# EAGLE design rocket-mega-shield (EAGLE 6.4)
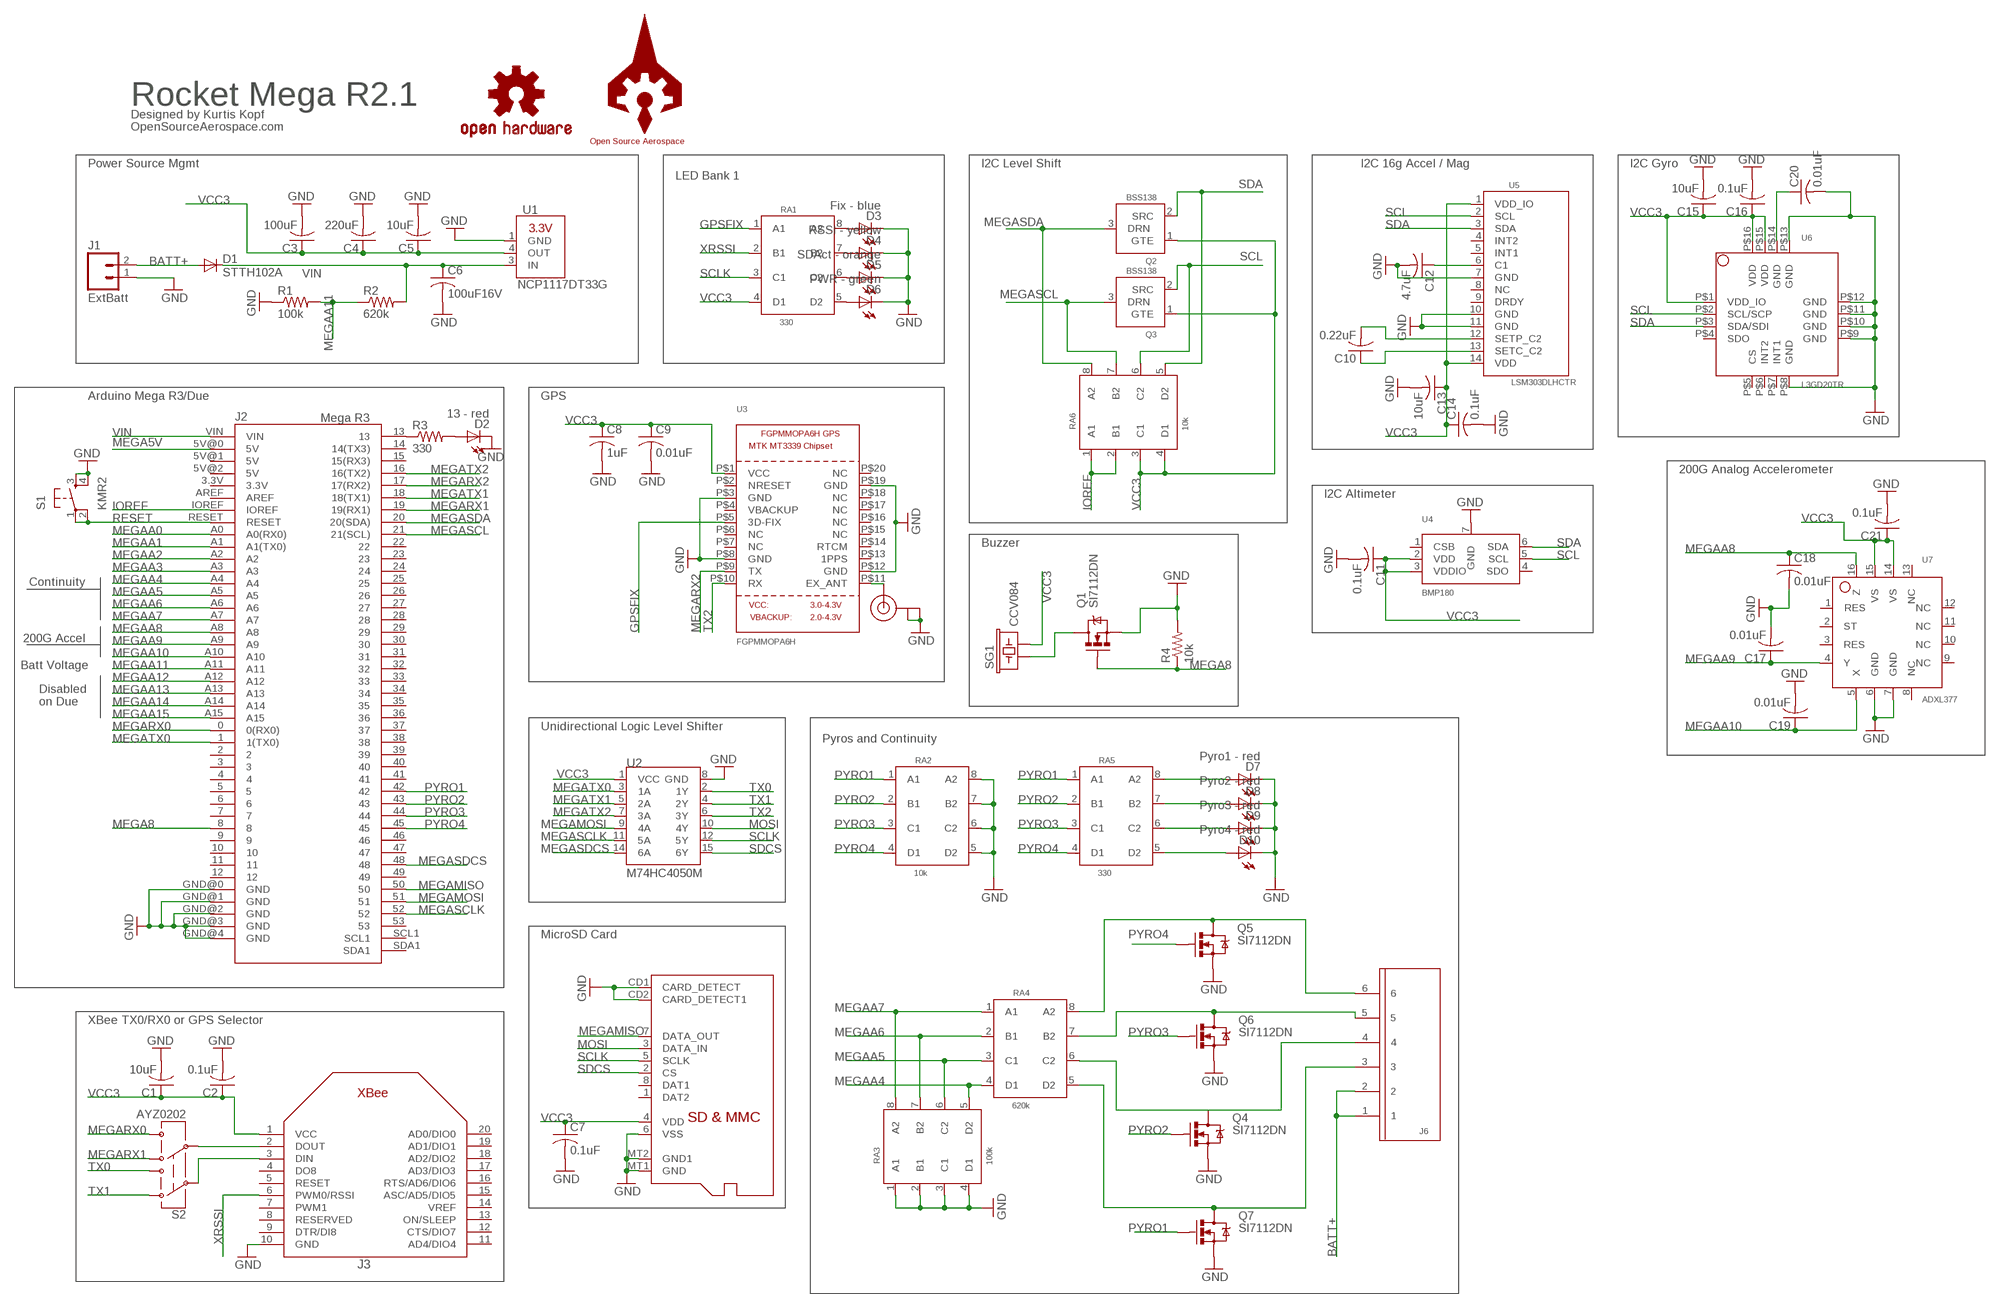
[diagram p0: schematic, sheet 1]

## Parts
C1  10uF  C-USC1206  [C1206]
C2  0.1uF  C-USC1206  [C1206]
C3  100uF  C-USC1206  [C1206]
C4  220uF  C-USC1210  [C1210]
C5  10uF  C-USC1206  [C1206]
C6  100uF16V  C-USC1210  [C1210]
C7  0.1uF  C-USC1206  [C1206]
C8  1uF  C-USC1206  [C1206]
C9  0.01uF  C-USC1206  [C1206]
C10  0.22uF  C-USC1206  [C1206]
C11  0.1uF  C-USC1206  [C1206]
C12  4.7uF  C-USC1206  [C1206]
C13  10uF  C-USC1206  [C1206]
C14  0.1uF  C-USC1206  [C1206]
C15  10uF  C-USC1206  [C1206]
C16  0.1uF  C-USC1206  [C1206]
C17  0.01uF  C-USC1206  [C1206]
C18  0.01uF  C-USC1206  [C1206]
C19  0.01uF  C-USC1206  [C1206]
C20  0.01uF  C-USC1206  [C1206]
C21  0.1uF  C-USC1206  [C1206]
D1  STTH102A  DIODESMA-ALT  [SMA-DIODE_ALT]
D2  13 - red  LED1206  [LED-1206]
D3  Fix - blue  LED1206  [LED-1206]
D4  RSSI - yellow  LED1206  [LED-1206]
D5  SDAct - orange  LED1206  [LED-1206]
D6  PWR - green  LED1206  [LED-1206]
D7  Pyro1 - red  LED1206  [LED-1206]
D8  Pyro2 - red  LED1206  [LED-1206]
D9  Pyro3 - red  LED1206  [LED-1206]
D10  Pyro4 - red  LED1206  [LED-1206]
J1  ExtBatt  M02-JST-2-PTH-NO_SILK  [JST-2-PTH-NS]
J2  Mega R3  ARDUINO-MEGAFULL  [ARDUINO_MEGA]
J3  XBEE  [XBEE]
J4  MICROSD  [MICROSD]
J5  U.FL  [U.FL]
J6  1X6TERMINALBLOCK  [1X6TERMINALBLOCK]
LOGO1  OSHW-LOGOM  [OSHW-LOGO-M]
Q1  SI7112DN  MOSFET-NCHANNELSI7820DN  [POWERPAK1212-8]
Q2  BSS138  [SOT23]
Q3  BSS138  [SOT23]
Q4  SI7112DN  MOSFET-NCHANNELSI7820DN  [POWERPAK1212-8]
Q5  SI7112DN  MOSFET-NCHANNELSI7820DN  [POWERPAK1212-8]
Q6  SI7112DN  MOSFET-NCHANNELSI7820DN  [POWERPAK1212-8]
Q7  SI7112DN  MOSFET-NCHANNELSI7820DN  [POWERPAK1212-8]
R1  100k  R-US_R1206  [R1206]
R2  620k  R-US_R1206  [R1206]
R3  330  R-US_R1206  [R1206]
R4  10k  R-US_R1206  [R1206]
RA1  330  RESISTOR_CRA06S08  [1206X4RESISTORARRAY]
RA2  10k  RESISTOR_CRA06S08  [1206X4RESISTORARRAY]
RA3  100k  RESISTOR_CRA06S08  [1206X4RESISTORARRAY]
RA4  620k  RESISTOR_CRA06S08  [1206X4RESISTORARRAY]
RA5  330  RESISTOR_CRA06S08  [1206X4RESISTORARRAY]
RA6  10k  RESISTOR_CRA06S08  [1206X4RESISTORARRAY]
S1  KMR2  TAC_SWITCHKMR2  [TACTILE_KMR2]
S2  AYZ0202  [AYZ0202]
SG1  CCV084  BUZZERSMD2  [BUZZER-CCV]
U1  NCP1117DT33G  [DPAK]
U2  M74HC4050M  HEX_CONVERTER  [SO016]
U3  FGPMMOPA6H  GPS_FGPMMOPA6H  [FGPMMOPA6H]
U4  BMP180  [BMP180]
U5  LSM303DLHCTR  LSM303DLHC  [LGA14]
U6  L3GD20TR  L3GD20  [LGA16-4X4]
U7  ADXL377  [LFCSP-16]
U$1  OSAEROSPACEVECTOR  [OSAEROSPACE_V]

## Nets
BATT+ [raw]: D1.A J1.2 J6.1 J6.2
GND: C1.2 C2.2 C3.2 C4.2 C5.2 C6.2 C7.2 C8.2 C9.2 C11.2 C12.2 C13.2 C14.2 C15.2 C16.2 C17.2 C18.2 C19.2 C20.2 C21.2 D2.C D3.C D4.C D5.C D6.C D7.C D8.C D9.C D10.C J1.1 J2.GND@0(GND) J2.GND@1(GND) J2.GND@2(GND) J2.GND@3(GND) J2.GND@4(GND) J3.10(GND) J4.6(VSS) J4.CD1(CARD_DETECT) J4.CD2(CARD_DETECT1) J4.MT1(GND) J4.MT2(GND1) J5.P$1(GND) J5.P$2(GND) Q1.S1(S) Q1.S2(S) Q1.S3(S) Q4.S1(S) Q4.S2(S) Q4.S3(S) Q5.S1(S) Q5.S2(S) Q5.S3(S) Q6.S1(S) Q6.S2(S) Q6.S3(S) Q7.S1(S) Q7.S2(S) Q7.S3(S) R1.1 R4.2 RA2.5(D2) RA2.6(C2) RA2.7(B2) RA2.8(A2) RA3.1(A1) RA3.2(B1) RA3.3(C1) RA3.4(D1) S1.3 S1.4 U1.1(GND) U2.8(GND) U3.P$3(GND) U3.P$8(GND) U3.P$12(GND) U3.P$19(GND) U4.7(GND) U5.7(GND) U5.10(GND) U5.11(GND) U6.P$8(GND) U6.P$9(GND) U6.P$10(GND) U6.P$11(GND) U6.P$12(GND) U6.P$13(GND) U7.6(GND) U7.7(GND)
GPSFIX: RA1.1(A1) U3.P$5(3D-FIX)
IOREF: J2.IOREF RA6.1(A1) RA6.2(B1)
MEGA5V [pwr]: J2.5V@0(5V)
MEGA8: J2.8 Q1.G R4.1
MEGAA0: J2.A0(A0(RX0))
MEGAA1: J2.A1(A1(TX0))
MEGAA2: J2.A2
MEGAA3: J2.A3
MEGAA4: J2.A4 RA3.5(D2) RA4.4(D1)
MEGAA5: J2.A5 RA3.6(C2) RA4.3(C1)
MEGAA6: J2.A6 RA3.7(B2) RA4.2(B1)
MEGAA7: J2.A7 RA3.8(A2) RA4.1(A1)
MEGAA8: C18.1 J2.A8 U7.16(Z)
MEGAA9: C17.1 J2.A9 U7.4(Y)
MEGAA10: C19.1 J2.A10 U7.5(X)
MEGAA11: J2.A11 R1.2 R2.1
MEGAA12: J2.A12
MEGAA13: J2.A13
MEGAA14: J2.A14
MEGAA15: J2.A15
MEGAMISO: J2.50 J4.7(DATA_OUT)
MEGAMOSI: J2.51 U2.9(4A)
MEGARX0: J2.0(0(RX0)) S2.4
MEGARX1: J2.19(19(RX1)) S2.6
MEGARX2: J2.17(17(RX2)) U3.P$9(TX)
MEGASCL: J2.21(21(SCL)) Q3.3(DRN) RA6.7(B2)
MEGASCLK: J2.52 U2.11(5A)
MEGASDA: J2.20(20(SDA)) Q2.3(DRN) RA6.8(A2)
MEGASDCS: J2.48 U2.14(6A)
MEGATX0: J2.1(1(TX0)) U2.3(1A)
MEGATX1: J2.18(18(TX1)) U2.5(2A)
MEGATX2: J2.16(16(TX2)) U2.7(3A)
MOSI: J4.3(DATA_IN) U2.10(4Y)
N$1: D6.A RA1.5(D2)
N$2: D5.A RA1.6(C2)
N$3: J6.3 Q7.D1(D) Q7.D2(D) Q7.D3(D) Q7.D4(D) Q7.DPAD(D) RA4.5(D2)
N$4: J6.4 Q4.D1(D) Q4.D2(D) Q4.D3(D) Q4.D4(D) Q4.DPAD(D) RA4.6(C2)
N$5: C10.2 U5.12(SETP_C2)
N$6: C10.1 U5.13(SETC_C2)
N$7: C12.1 U5.6(C1)
N$8: C20.1 U6.P$14(GND)
N$9: J2.13 R3.1
N$10: J5.P$3(SIGNAL) U3.P$11(EX_ANT)
N$11: D4.A RA1.7(B2)
N$12: D3.A RA1.8(A2)
N$13: Q1.D1(D) Q1.D2(D) Q1.D3(D) Q1.D4(D) Q1.DPAD(D) SG1.+
N$14: D2.A R3.2
N$16: D10.A RA5.5(D2)
N$17: D9.A RA5.6(C2)
N$18: D8.A RA5.7(B2)
N$19: D7.A RA5.8(A2)
N$21: J3.2(DOUT) S2.5
N$22: J3.3(DIN) S2.2
N$24: J6.6 Q5.D1(D) Q5.D2(D) Q5.D3(D) Q5.D4(D) Q5.DPAD(D) RA4.8(A2)
N$25: J6.5 Q6.D1(D) Q6.D2(D) Q6.D3(D) Q6.D4(D) Q6.DPAD(D) RA4.7(B2)
PYRO1: J2.42 Q7.G RA2.1(A1) RA5.1(A1)
PYRO2: J2.43 Q4.G RA2.2(B1) RA5.2(B1)
PYRO3: J2.44 Q6.G RA2.3(C1) RA5.3(C1)
PYRO4: J2.45 Q5.G RA2.4(D1) RA5.4(D1)
RESET: J2.RESET S1.1 S1.2
SCL: Q3.2(SRC) RA6.6(C2) U4.5(SCL) U5.2(SCL) U6.P$2(SCL/SCP)
SCLK: J4.5(SCLK) RA1.3(C1) U2.12(5Y)
SDA: Q2.2(SRC) RA6.5(D2) U4.6(SDA) U5.3(SDA) U6.P$3(SDA/SDI)
SDCS: J4.2(CS) U2.15(6Y)
TX0: S2.1 U2.2(1Y)
TX1: S2.3 U2.4(2Y)
TX2: U2.6(3Y) U3.P$10(RX)
VCC3 [pwr]: C1.1 C2.1 C3.1 C4.1 C5.1 C7.1 C8.1 C9.1 C11.1 C13.1 C14.1 C15.1 C16.1 C21.1 J3.1(VCC) J4.4(VDD) Q2.1(GTE) Q3.1(GTE) RA1.4(D1) RA6.3(C1) RA6.4(D1) SG1.- U1.4(OUT) U2.1(VCC) U3.P$1(VCC) U4.2(VDD) U4.3(VDDIO) U5.1(VDD_IO) U5.14(VDD) U6.P$1(VDD_IO) U6.P$15(VDD) U6.P$16(VDD) U7.14(VS) U7.15(VS)
VIN [pwr]: C6.1 D1.C J2.VIN R2.2 U1.3(IN)
XRSSI: J3.6(PWM0/RSSI) RA1.2(B1)
Unconnected: J2.2 J2.3 J2.3.3V J2.4 J2.5 J2.5V@1(5V) J2.5V@2(5V) J2.6 J2.7 J2.9 J2.10 J2.11 J2.12 J2.14(14(TX3)) J2.15(15(RX3)) J2.22 J2.23 J2.24 J2.25 J2.26 J2.27 J2.28 J2.29 J2.30 J2.31 J2.32 J2.33 J2.34 J2.35 J2.36 J2.37 J2.38 J2.39 J2.40 J2.41 J2.46 J2.47 J2.49 J2.53 J2.AREF J2.SCL1 J2.SDA1 J3.4(DO8) J3.5(RESET) J3.7(PWM1) J3.8(RESERVED) J3.9(DTR/DI8) J3.11(AD4/DIO4) J3.12(CTS/DIO7) J3.13(ON/SLEEP) J3.14(VREF) J3.15(ASC/AD5/DIO5) J3.16(RTS/AD6/DIO6) J3.17(AD3/DIO3) J3.18(AD2/DIO2) J3.19(AD1/DIO1) J3.20(AD0/DIO0) J4.1(DAT2) J4.8(DAT1) U3.P$2(NRESET) U3.P$4(VBACKUP) U3.P$6(NC) U3.P$7(NC) U3.P$13(1PPS) U3.P$14(RTCM) U3.P$15(NC) U3.P$16(NC) U3.P$17(NC) U3.P$18(NC) U3.P$20(NC) U4.1(CSB) U4.4(SDO) U5.4(INT2) U5.5(INT1) U5.8(NC) U5.9(DRDY) U6.P$4(SDO) U6.P$5(CS) U6.P$6(INT2) U6.P$7(INT1) U7.1(RES) U7.2(ST) U7.3(RES) U7.8(NC) U7.9(NC) U7.10(NC) U7.11(NC) U7.12(NC) U7.13(NC)

## Notes on the sheet
- Rocket Mega R2.1
- Designed by Kurtis Kopf
- OpenSourceAerospace.com
- Power Source Mgmt | I2C Level Shift | I2C 16g Accel / Mag | I2C Gyro
- LED Bank 1
- Arduino Mega R3/Due | GPS
- 200G Analog Accelerometer
- I2C Altimeter
- Buzzer
- Continuity
- 200G Accel
- Batt Voltage
- Disabled
  on Due
- Unidirectional Logic Level Shifter
- Pyros and Continuity
- MicroSD Card
- XBee TX0/RX0 or GPS Selector

## Library data of the parts
C1-C21 = adafruit:C-US: CAPACITOR, American symbol
D1 = SparkFun-DiscreteSemi:DIODE: Diode These are standard reverse protection diodes and small signal diodes. SMA package can handle up to about 1A. SOD-323 can handle about 200mA. What the SOD-323 package when ordering, there are some mfgs out there that are 5-pin packages.
D2-D10 = SparkFun-LED:LED: LEDs Standard schematic elements and footprints for 5mm, 3mm, 1206, and 0603 sized LEDs. 5mm - Spark Fun Electronics SKU : COM-00529 (and others)
J1 = SparkFun-Connectors:M02: Header 2 Standard 2-pin 0.1" header. Use with straight break away headers (SKU : PRT-00116), right angle break away headers (PRT-00553), swiss pins (PRT-00743), machine pins (PRT-00117), and female headers (PRT-00115). Molex polarized connector foot print use with SKU : PRT-08233 with associated crimp pins and housings.
J2 = zortness:ARDUINO-MEGA: Arduino MegaR3 board footprint. Also works for Due.
J3 = zortness:XBEE
J4 = zortness:MICROSD: MicroSD Connector DigiKey <http://www.digikey.com/product-detail/en/693071010811/732-3819-1-ND/3124603> datasheet <http://katalog.we-online.de/em/datasheet/693071010811.pdf> Micro-SD / Transflash card holder with SPI pinout For the 3M # 2908-05WB-MG and/or 4UCON #19656 push-push type
J5 = SparkFun-Connectors:U.FL: SMD antenna connector- WRL-09144
J6 = zortness:1X6TERMINALBLOCK: 1x6 Terminal Block at 0.01" (2.54mm) pitch DigiKey <http://www.digikey.com/product-detail/en/282834-5/A98336-ND/1153266>
LOGO1 = SparkFun-Aesthetics:OSHW-LOGO: Open Source Hardware Logo This logo indicates the piece of hardware it is found on incorporates a OSHW license and/or adheres to the definition of open source hardware found here: http://freedomdefined.org/OSHW
Q1 Q4-Q7 = zortness:MOSFET-NCHANNEL: Common NMOSFET Parts MFG P/N Store ID Prod ID FDD8780 TRANS-09984 SI7820DN TRANS-11055 FDS6630A IC-08089 2N7002PW TRANS-11151 FQP30N06L COM-10213 TRANS-10060 BSS123LT1G TRANS-08345 BSS138 TRANS-00830 BS170 2N7000; PROD_ID: TRANS-11055
Q2 Q3 = kurt:BSS138
R1-R4 = adafruit:R-US_: RESISTOR, American symbol
RA1-RA6 = zortness:RESISTOR_CRA06S08: 4-Channel Resistor Array Vishay CRA06S08 series DigiKey example <http://www.digikey.com/product-detail/en/CRA06S0831K00JTA/CRA6S81.0KCT-ND/1285879> Datasheet <http://www.vishay.com/docs/31002/cra06es.pdf>
S1 = zortness:TAC_SWITCH: Momentary Switch Button commonly used for reset or general input. Spark Fun Electronics SKU : COM-00097 SMT- SWCH-08247
S2 = SparkFun-Electromechanical:AYZ0202: SPDT Slide Switch Simple SMD single-pull double-throw slide switch. Good for less than 350mA power switch, switching UARTs between devices, etc. Spark Fun Electronics SKU : COM-00597
SG1 = SparkFun-Electromechanical:BUZZER: Buzzer 12mm Spark Fun Electronics SKU : Comp-Buzzer
U1 = zortness:NCP1117DT33G: NCP1117DT33G 3.3V Voltage Regulator DigiKey PN NCP1117DT33GOS-ND <http://www.digikey.com/product-detail/en/NCP1117DT33G/NCP1117DT33GOS-ND/1483318> Requires stabilizing capacitors
U2 = SparkFun-DigitalIC:HEX_CONVERTER: Just what it says.
U3 = zortness:GPS_FGPMMOPA6H: GPS Module - MTK MT3339 Chipset, -165dBm sensitivity, 22 channels, 10Hz, auto-select external antenna options
U4 = zortness:BMP180: Bosch BMP180 Altimeter Modified LGA-7 package Code compatable with BMP085 DigiKey <http://www.digikey.com/product-detail/en/BMP180/828-1027-1-ND/2688260> Datasheet <http://ae-bst.resource.bosch.com/media/products/dokumente/bmp180/BST-BMP180-DS000-08.pdf>
U5 = kurt:LSM303DLHC: LSM303DLHC High Performance e-compass, 3D accelerometer, and 3D magnometer I2C communication 2g, 4g, 8g, 16g 1.3, 1.9, 2.5, 4.0, 4.7, 5.6, 8.1 gauss DigiKey PN 497-11918-1-ND <http://www.digikey.com/product-detail/en/LSM303DLHCTR/497-11918-1-ND/2757636>
U6 = kurt:L3GD20: L3GD20 3-Axis Gyro I2C or SPI communication DigKey <http://www.digikey.com/product-detail/en/L3GD20TR/497-12081-1-ND/2793125>
U7 = zortness:ADXL377: ADXL377 3-Axis 200G analog accelerometer DigiKey <http://www.digikey.com/product-detail/en/ADXL377BCPZ-RL7/ADXL377BCPZ-RL7CT-ND/3678489> Data Sheet <http://www.analog.com/static/imported-files/data_sheets/ADXL377.pdf> Breakout Board <http://www.adafruit.com/products/1413>
U$1 = zortness:OSAEROSPACE

## Net classes
1 pwr: width 0.305 mm
2 raw: width 0.305 mm

## Board
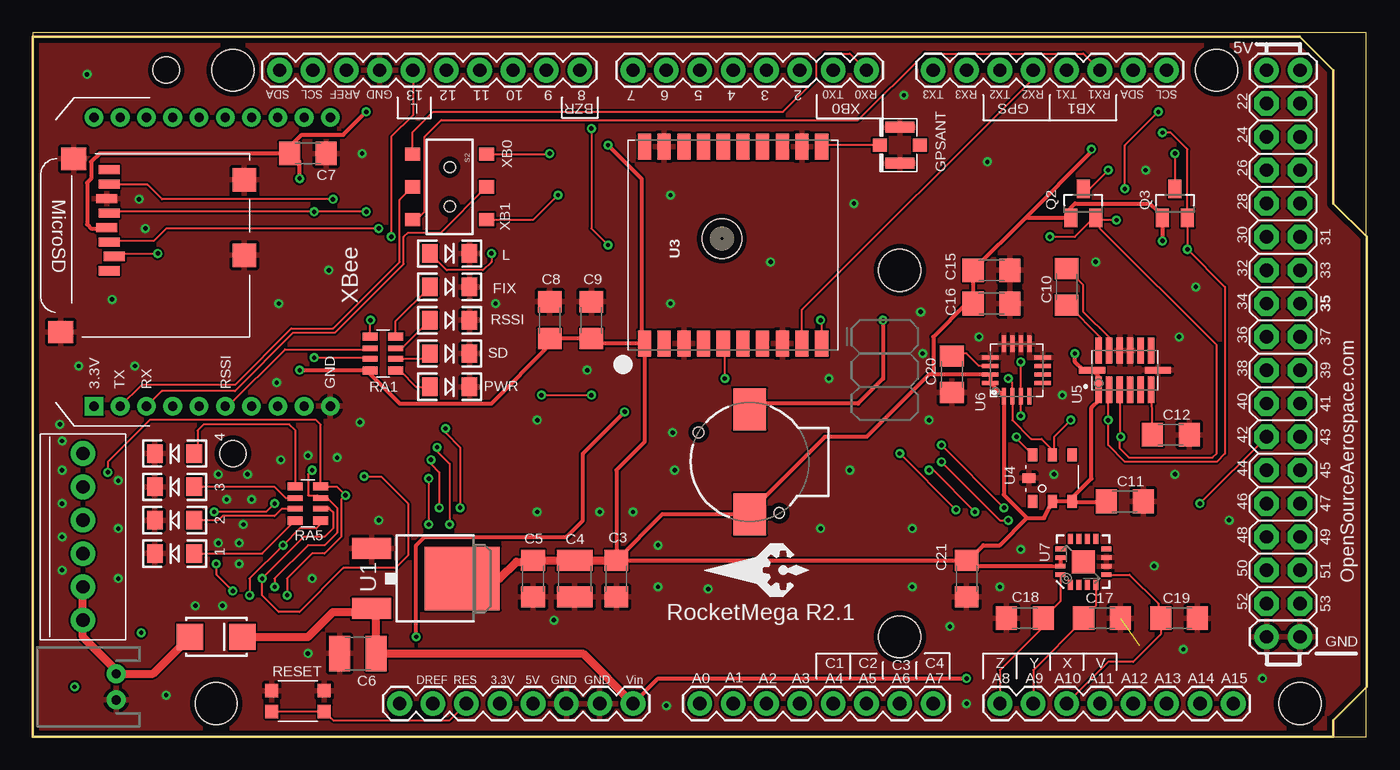
[diagram p1: board, top side]
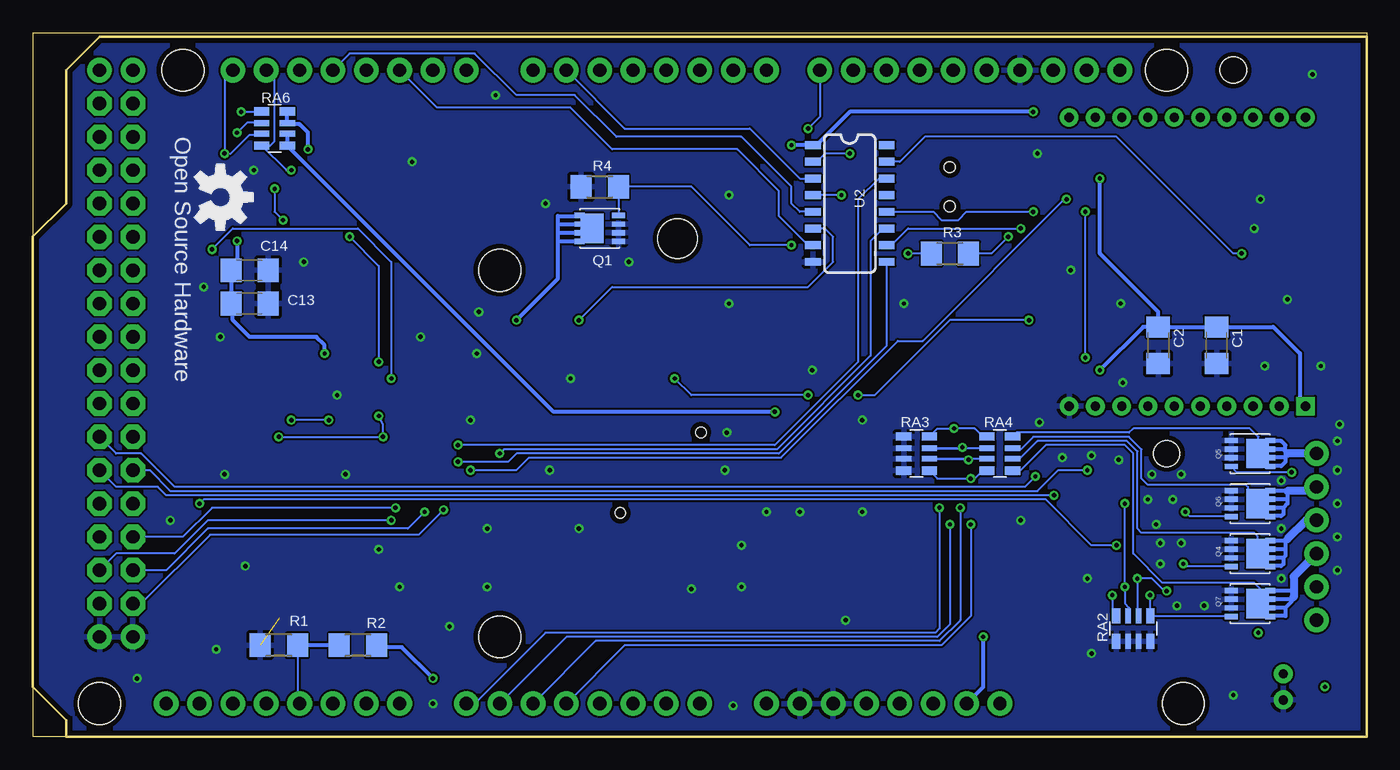
[diagram p2: board, bottom side, seen from below]

Size 101.6 x 53.65 mm. Coordinates in mm from the lower left corner, seen from the top.
Outline: 0,0 101.58,0 101.58,53.65 0,53.65 0,0
Copper layers (1*16): Top 0.0356mm / dielectric 1.5011mm / Bottom 0.0356mm
Design rules "LaenPCBOrder": minimum track width 6mil, minimum drill 13mil, track to track 6mil, track to pad 6mil, pad to pad 6mil, via to via 6mil, smd to smd 6mil, copper to edge 15mil, drill to drill 6mil, minimum pad ring 7mil, minimum via ring 7mil, stop-mask expansion 4mil, vias tented up to drill 0mil, thermal gap 10mil
Holes 2 mm at 10.16,50.8 15.24,21.59

### Footprints (pad centres in the part's own frame; a part is rotated, then mirrored left to right if it is on the bottom)
C1206 = smd 1.6 x 1.8: 1 -1.4,0; 2 1.4,0
C1210 = smd 1.6 x 2.7: 1 -1.4,0; 2 1.4,0
SMA-DIODE_ALT = smd 2 x 2: A -2,0; C 2,0
LED-1206 = smd 1.2 x 1.4: A -1.5,0; C 1.5,0
JST-2-PTH-NS = drill 0.7 pad 1.448: 1 -1,0; 2 1,0
ARDUINO_MEGA = drill 1.016 pad 1.88: 0 63.5,50.8; 1 60.96,50.8; 2 58.42,50.8; 3 55.88,50.8; 3.3V 35.56,2.54; 4 53.34,50.8; 5 50.8,50.8; 5V@0 38.1,2.54; 5V@1 93.98,50.8; 5V@2 96.52,50.8; 6 48.26,50.8; 7 45.72,50.8; 8 41.656,50.8; 9 39.116,50.8; 10 36.576,50.8; 11 34.036,50.8; 12 31.496,50.8; 13 28.956,50.8; 14 68.58,50.8; 15 71.12,50.8; 16 73.66,50.8; 17 76.2,50.8; 18 78.74,50.8; 19 81.28,50.8; 20 83.82,50.8; 21 86.36,50.8; A0 50.8,2.54; A1 53.34,2.54; A2 55.88,2.54; A3 58.42,2.54; A4 60.96,2.54; A5 63.5,2.54; A6 66.04,2.54; A7 68.58,2.54; A8 73.66,2.54; A9 76.2,2.54; A10 78.74,2.54; A11 81.28,2.54; A12 83.82,2.54; A13 86.36,2.54; A14 88.9,2.54; A15 91.44,2.54; AREF 23.876,50.8; EMPTY 27.94,2.54; GND@0 40.64,2.54; GND@1 43.18,2.54; GND@2 93.98,7.62; GND@3 96.52,7.62; GND@4 26.416,50.8; IOREF 30.48,2.54; RESET 33.02,2.54; SCL1 21.336,50.8; SDA1 18.796,50.8; VIN 45.72,2.54 | drill 1.016 pad 1.88 octagon: 22 93.98,48.26; 23 96.52,48.26; 24 93.98,45.72; 25 96.52,45.72; 26 93.98,43.18; 27 96.52,43.18; 28 93.98,40.64; 29 96.52,40.64; 30 93.98,38.1; 31 96.52,38.1; 32 93.98,35.56; 33 96.52,35.56; 34 93.98,33.02; 35 96.52,33.02; 36 93.98,30.48; 37 96.52,30.48; 38 93.98,27.94; 39 96.52,27.94; 40 93.98,25.4; 41 96.52,25.4; 42 93.98,22.86; 43 96.52,22.86; 44 93.98,20.32; 45 96.52,20.32; 46 93.98,17.78; 47 96.52,17.78; 48 93.98,15.24; 49 96.52,15.24; 50 93.98,12.7; 51 96.52,12.7; 52 93.98,10.16; 53 96.52,10.16 | hole 3.2: 15.24,50.8; 13.97,2.54; 66.04,35.56; 66.04,7.62; 90.17,50.8; 96.52,2.54
XBEE = drill 0.7 pad 1.422 square: 1 -11,5.5 | drill 0.7 pad 1.422: 2 -11,3.5; 3 -11,1.5; 4 -11,-0.5; 5 -11,-2.5; 6 -11,-4.5; 7 -11,-6.5; 8 -11,-8.5; 9 -11,-10.5; 10 -11,-12.5; 11 11,-12.5; 12 11,-10.5; 13 11,-8.5; 14 11,-6.5; 15 11,-4.5; 16 11,-2.5; 17 11,-0.5; 18 11,1.5; 19 11,3.5; 20 11,5.5
MICROSD = smd 0.7 x 1.6: 1 8.94,-10.7; 2 7.84,-10.3; 3 6.74,-10.7; 4 5.64,-10.9; 5 4.54,-10.7; 6 3.44,-10.9; 7 2.34,-10.7; 8 1.24,-10.7 | smd 1.8 x 1.8: CD1 2,-0.4; CD2 7.75,-0.4 | smd 1.7 x 1.9: MT1 0.4,-13.4; MT2 13.6,-14.4
U.FL = smd 2.2 x 0.85: P$1 0,1.375; P$2 0,-1.375 | smd 1.05 x 1: P$3 1.525,0; P$4 -1.525,0
1X6TERMINALBLOCK = drill 1.016 pad 1.88: 1 -6.35,0; 2 -3.81,0; 3 -1.27,0; 4 1.27,0; 5 3.81,0; 6 6.35,0
POWERPAK1212-8 = smd 0.762 x 0.406: D1 1.549,0.991; D2 1.549,0.33; D3 1.549,-0.33; D4 1.549,-0.991 | smd 1.727 x 2.235: DPAD 0.584,0 | smd 0.991 x 0.406: G -1.422,-0.991; S1 -1.422,0.991; S2 -1.422,0.33; S3 -1.422,-0.33
SOT23 = smd 1 x 1.4: 1 -0.95,-1.1; 2 0.95,-1.1; 3 0,1.1
R1206 = smd 1.6 x 1.803: 1 -1.422,0; 2 1.422,0
1206X4RESISTORARRAY = smd 0.63 x 1.15: 1 -1.3,-0.975; 4 1.3,-0.975; 5 1.3,0.975; 8 -1.3,0.975 | smd 0.44 x 1.15: 2 -0.4,-0.975; 3 0.4,-0.974; 6 0.4,0.975; 7 -0.4,0.975
TACTILE_KMR2 = smd 1 x 1: 1 0.5,-0.5; 2 4.5,-0.5; 3 0.5,-2.1; 4 4.5,-2.1
AYZ0202 = smd 1 x 1.15: 1 -2.5,2.825; 2 0,2.825; 3 2.5,2.825; 4 -2.5,-2.825; 5 0,-2.825; 6 2.5,-2.825 | hole 0.85: 1.5,0; -1.5,0
BUZZER-CCV = smd 3.2 x 2.5: + 4,0; - -4,0 | hole 0.8: -3.9,-2.25; 2.25,3.9
DPAK = smd 1.6 x 3: 1 -2.28,-5.31; 3 2.28,-5.31 | smd 4.826 x 5.715: 4 0,1.588
SO016 = smd 0.6 x 1.2: 1 -4.445,-2.8; 2 -3.175,-2.8; 3 -1.905,-2.8; 4 -0.635,-2.8; 5 0.635,-2.8; 6 1.905,-2.8; 7 3.175,-2.8; 8 4.445,-2.8; 9 4.445,2.8; 10 3.175,2.8; 11 1.905,2.8; 12 0.635,2.8; 13 -0.635,2.8; 14 -1.905,2.8; 15 -3.175,2.8; 16 -4.445,2.8
FGPMMOPA6H = smd 2 x 1: P$1 -7.5,6.75; P$2 -7.5,5.25; P$3 -7.5,3.75; P$4 -7.5,2.25; P$5 -7.5,0.75; P$6 -7.5,-0.75; P$7 -7.5,-2.25; P$8 -7.5,-3.75; P$9 -7.5,-5.25; P$10 -7.5,-6.75; P$11 7.5,-6.75; P$12 7.5,-5.25; P$13 7.5,-3.75; P$14 7.5,-2.25; P$15 7.5,-0.75; P$16 7.5,0.75; P$17 7.5,2.25; P$18 7.5,3.75; P$19 7.5,5.25; P$20 7.5,6.75 | hole 3: 0.5,0.85
BMP180 = smd 1 x 0.7: 1 0,-0.275; 2 0,-1.775; 3 0,-3.275; 4 3.55,-3.275; 5 3.55,-1.775; 6 3.55,-0.275 | smd 0.7 x 1: 7 1.775,0
LGA14 = smd 0.5 x 2: 1 2,1.5; 2 1.2,1.5; 3 0.4,1.5; 4 -0.4,1.5; 5 -1.2,1.5; 6 -2,1.5; 8 -2,-1.5; 9 -1.2,-1.5; 10 -0.4,-1.5; 11 0.4,-1.5; 12 1.2,-1.5; 13 2,-1.5 | smd 2 x 0.5: 7 -2.5,0; 14 2.5,0
LGA16-4X4 = smd 1.25 x 0.3: P$1 -2,0.975; P$2 -2,0.325; P$3 -2,-0.325; P$4 -2,-0.975; P$9 2,-0.975; P$10 2,-0.325; P$11 2,0.325; P$12 2,0.975 | smd 0.3 x 1.25: P$5 -0.975,-2; P$6 -0.325,-2; P$7 0.325,-2; P$8 0.975,-2; P$13 0.975,2; P$14 0.325,2; P$15 -0.325,2; P$16 -0.975,2
LFCSP-16 = smd 1.75 x 1.75: 0 0,0 | smd 0.75 x 0.37: 1 -1.75,0.975; 2 -1.75,0.325; 3 -1.75,-0.325; 4 -1.75,-0.975; 9 1.75,-0.975; 10 1.75,-0.325; 11 1.75,0.325; 12 1.75,0.975 | smd 0.37 x 0.75: 5 -0.975,-1.75; 6 -0.325,-1.75; 7 0.325,-1.75; 8 0.975,-1.75; 13 0.975,1.75; 14 0.325,1.75; 15 -0.325,1.75; 16 -0.975,1.75

### Placement (x,y rotation side)
C1  11.43,29.84 270 bottom
C2  15.88,29.84 270 bottom
C3  44.45,12.06 270 top
C4  41.27,12.06 270 top
C5  38.1,12.06 270 top
C6  24.77,6.35 180 top
C7  20.95,44.45 0 top
C8  39.37,31.75 90 top
C9  42.55,31.75 90 top
C10  78.74,34.29 90 top
C11  83.19,17.94 0 top
C12  86.68,23.02 0 top
C13  85.09,33.02 0 bottom
C14  85.09,35.56 0 bottom
C15  73.03,35.56 0 top
C16  73.03,33.02 0 top
C17  81.44,9.05 0 top
C18  75.56,9.05 180 top
C19  87.31,9.05 0 top
C20  70.01,27.62 270 top
C21  71.12,12.06 270 top
D1  13.97,7.62 0 top
D2  31.75,36.83 0 top
D3  31.75,34.29 0 top
D4  31.75,31.75 0 top
D5  31.75,29.21 0 top
D6  31.75,26.67 0 top
D7  10.79,13.97 180 top
D8  10.79,16.51 180 top
D9  10.79,19.05 180 top
D10  10.79,21.59 180 top
J1  6.35,3.81 90 top
J2  0,0 0 top
J3  10.16,36.2 90 top
J4  16.51,44.45 270 top
J5  66.04,45.09 180 top
J6  3.81,15.24 90 top
LOGO1  87.31,41.12 270 bottom
Q1  58.42,38.73 180 bottom
Q2  80.01,40.64 0 top
Q3  87,40.64 0 top
Q4  8.89,13.97 0 bottom
Q5  8.89,21.59 0 bottom
Q6  8.89,17.78 0 bottom
Q7  8.89,10.16 0 bottom
R1  82.87,6.99 0 bottom
R2  76.83,6.99 0 bottom
R3  31.75,36.83 180 bottom
R4  58.42,41.91 180 bottom
RA1  26.67,29.21 270 top
RA2  17.78,8.26 180 bottom
RA3  34.29,21.59 270 bottom
RA4  27.94,21.59 270 bottom
RA5  20.95,17.78 90 top
RA6  83.19,46.35 90 bottom
S1  22.7,1.43 180 top
S2  31.75,41.91 270 top
SG1  54.61,20.95 90 top
U1  31.11,12.06 270 top
U2  39.37,40.64 270 bottom
U3  53.34,37.47 90 top
U4  75.88,17.94 90 top
U5  83.19,27.94 180 top
U6  74.93,27.94 90 top
U7  80.01,13.34 90 top
U$1  57.15,12.7 90 top

### Tracks (layer width: path | path; a pad name or v marks a point on that pad's centre or on a via)
BATT+
  Top 0.61: J6.2 J6.1 3.81,7.62 6.35,5.08 J1.2 9.16,4.81 D1.A
GND  (via drill 0.33)  (1 unrouted)
  other vias: 2.22,22.54 2.22,20.32 2.22,17.78 2.22,15.24 2.22,12.7 6.51,19.53 15.72,14.76 14.13,14.76 21.27,12.06 12.38,10 14.45,10 20.95,6.35 10.16,3.17 16.67,18.1 14.13,20 16.35,20 3.49,28.26 6.03,33.34 4.13,50.48 60.01,15.88 85.41,13.02 39.69,8.89 48.26,2.38 68.26,24.13 78.42,26.04 67.63,32.38 91.12,16.51 87.31,30.48 87.63,6.67 66.99,11.43 73.66,11.43 88.58,34.29 72.71,43.81 62.55,40.64 25.08,44.45 22.54,35.56 38.42,24.13 42.23,27.94 60.64,27.3 35.24,33.02 84.77,43.18 23.18,21.27 15.72,13.18 6.51,15.88 6.51,12.06 26.35,16.51 38.42,17.14 8.57,38.73 8.1,40.96 77.79,20 24.92,23.97 2.06,23.81 14.76,18.1 45.72,17.14 93.66,4.45 87,20 71.12,2.54 51.44,11.27 47.62,11.43 18.89,21.11 16.03,16.19 66.36,48.9 48.58,41.27 48.58,33.02 48.74,23.18 67.79,29.21 48.9,20.32 62.23,20.32 66.99,15.88 18.73,33.02 75.25,14.29 80.96,36.2 72.07,30.48 7.78,28.26 18.57,26.99 20.95,21.43 56.2,36.2 43.18,17.14 47.62,14.61 69.85,8.41
  pour Bottom: 0,53.34 0,0 101.6,0 101.6,53.34
  pour Top: -0.64,53.34 0,0 101.6,0 101.6,53.34
GPSFIX  (via drill 0.33)
  Top 0.152: RA1.1 25.7,31.73 v25.72,31.75 | v38.73,26.04 v42.55,26.04 | v52.7,27.3 52.7,29.21 U3.P$5
  Bottom 0.152: v25.72,31.75 31.75,31.75 37.47,26.04 v38.73,26.04 | v42.55,26.04 51.44,26.04 v52.7,27.3
IOREF  (via drill 0.33)
  Top 0.305: v29.21,7.62 29.21,14.61 29.84,15.24 40.64,15.24 41.91,16.51 41.91,21.59 v45.09,24.77
  Bottom 0.305: RA6.2 RA6.1 61.92,24.77 v45.09,24.77 | J2.IOREF 29.21,3.81 v29.21,7.62
MEGA8  (via drill 0.33)
  Top 0.152: v42.55,46.35 42.55,38.73 v43.81,37.47
  Bottom 0.152: J2.8 41.66,47.24 v42.55,46.35 | v43.81,37.47 46.99,37.47 51.44,41.91 R4.1 Q1.G | Q1.G
MEGAA4  (via drill 0.33)
  Top 0.152: v30.16,19.68 v30.16,16.19
  Bottom 0.152: RA4.4 29.24,20.29 29.84,19.68 v30.16,19.68 32.7,19.68 | 32.7,19.68 32.71,19.68 RA3.5 32.7,19.68 | v30.16,16.19 30.16,9.21 32.38,6.99 56.52,6.99 J2.A4
MEGAA5  (via drill 0.33)
  Top 0.152: v30.32,21.11 30.32,20.8 30.96,20.16 v30.96,17.46
  Bottom 0.152: RA4.3 RA3.6 30.4,21.19 v30.32,21.11 | v30.96,17.46 30.96,8.89 32.54,7.3 58.74,7.3 J2.A5
MEGAA6  (via drill 0.33)
  Top 0.152: v30.8,22.07 30.8,21.75 31.75,20.8 v31.75,16.19
  Bottom 0.152: RA4.2 RA3.7 30.87,21.99 v30.8,22.07 | v31.75,16.19 31.75,8.57 32.7,7.62 60.96,7.62 J2.A6
MEGAA7  (via drill 0.33)
  Top 0.152: v31.43,23.5 31.43,23.18 32.54,22.07 v32.54,17.46
  Bottom 0.152: RA4.1 29.24,22.89 29.84,23.5 v31.43,23.5 32.7,23.5 | 32.7,23.5 32.71,23.5 RA3.8 32.7,23.5 | v32.54,17.46 32.54,8.26 32.86,7.94 62.55,7.94 67.94,2.54 J2.A7
MEGAA8
  Top 0.152: U7.16 78.26,10.34 C18.1 76.97,8.38 73.66,5.08 J2.A8
MEGAA9
  Top 0.152: U7.4 80.98,9.99 C17.1 80.04,8.92 76.2,5.08 J2.A9
MEGAA10
  Top 0.152: U7.5 83.53,12.36 85.72,10.16 85.72,9.24 C19.1 85.91,7.81 83.82,5.71 81.92,5.71 J2.A10
MEGAA11
  Bottom 0.152: R1.2 81.44,2.71 J2.A11
  Bottom 0.305: R2.1 R1.2
MEGAMISO  (via drill 0.33)
  Top 0.152: J4.7 6.01,41.91 6.35,41.91 6.51,42.07 8.73,42.07 9.84,40.96 v22.86,40.96 | v68.26,20.32 68.58,20.32 v71.75,17.14
  Bottom 0.152: v22.86,40.96 23.02,40.96 33.81,30.16 35.72,30.16 44.61,21.27 63.82,21.27 64.77,20.32 v68.26,20.32 | v71.75,17.14 73.03,15.88 88.27,15.88 91.44,12.7 J2.50
MEGAMOSI  (via drill 0.33)
  Top 0.152: v69.22,20.95 73.66,16.51 v74.3,16.51
  Bottom 0.152: U2.9 36.57,29.79 44.77,21.59 64.77,21.59 65.41,20.95 v69.22,20.95 | v74.3,16.51 88.27,16.51 90.81,13.97 95.25,13.97 J2.51
MEGARX0
  Top 0.152: S2.4 28.93,46.07 30.48,47.62 57.15,47.62 59.69,50.16 59.69,51.44 60.33,52.07 62.23,52.07 J2.0
MEGARX1
  Top 0.152: S2.6 29.25,39.41 29.84,40.01 29.84,45.72 31.11,46.99 62.87,46.99 67.94,52.07 80.01,52.07 J2.19
MEGARX2
  Top 0.152: U3.P$9 58.59,32.55 76.2,50.16 J2.17
MEGASCL  (via drill 0.33)
  Top 0.152: v87,44.45 Q3.3
  Bottom 0.152: J2.21 87,50.8 v87,44.45 86.52,44.45 85.09,45.88 84.24,45.88 RA6.7 | RA6.7 84.54,45.95 | 84.24,46.04 RA6.7
MEGASCLK  (via drill 0.33)
  Top 0.152: v66.04,21.59 v70.33,17.3
  Bottom 0.152: U2.11 36.83,38.73 37.78,37.78 37.78,29.05 44.93,21.91 65.72,21.91 v66.04,21.59 | v70.33,17.3 72.23,15.4 88.11,15.4 93.34,10.16 J2.52
MEGASDA  (via drill 0.33)
  Top 0.152: Q2.3 80.47,41.74 v81.92,43.18
  Bottom 0.152: v81.92,43.18 82.28,43.18 RA6.8 83.53,45.05 83.19,45.4 83.19,50.16 J2.20
MEGASDCS  (via drill 0.33)
  Top 0.152: v69.22,22.23 v73.98,17.46
  Bottom 0.152: U2.14 37.15,42.55 38.73,40.96 38.73,28.57 45.09,22.23 v69.22,22.23 | v73.98,17.46 87.95,17.46 90.17,15.24 J2.48
MEGATX0
  Bottom 0.152: J2.1 56.52,46.35 46.99,46.35 43.18,42.55 U2.3
MEGATX1
  Bottom 0.152: U2.5 43.18,40.01 43.81,40.64 43.81,41.91 47.62,45.72 57.15,45.72 60.33,48.9 64.77,48.9 67.94,52.07 77.47,52.07 J2.18
MEGATX2
  Bottom 0.152: U2.7 42.55,37.47 44.77,39.69 44.77,41.59 47.94,44.77 57.47,44.77 60.64,47.94 70.8,47.94 J2.16
MOSI  (via drill 0.33)
  Top 0.152: v26.35,38.73 10.16,38.73 9.21,37.78 5.88,37.78 J4.3
  Bottom 0.152: U2.10 36.2,37.47 34.92,38.73 v26.35,38.73
N$1
  Top 0.152: RA1.5 27.97,27.91 29.21,26.67 D6.A
N$2
  Top 0.152: RA1.6 29.85,28.81 D5.A
N$3
  Bottom 0.152: RA4.5 26.93,20.32 26.35,20.32 24.45,22.23 18.41,22.23 17.78,21.59 17.78,13.97 15.56,11.75 8.57,11.75 7.98,11.15 | Q7.D1 7.98,11.15 | Q7.DPAD 8.31,10.82 7.98,11.15
  Bottom 0.305: 5.56,10.64 5.71,11.11 | 5.71,11.11 7.3,11.11 Q7.D1 | 5.71,11.11 5.71,10.48 | 5.71,10.48 7.33,10.48 Q7.D2 | 5.71,10.48 5.71,10.32 6.19,9.84 | 6.19,9.84 7.33,9.84 Q7.D3 | 6.19,9.84 6.19,9.21 7.3,9.21 Q7.D4
  Bottom 0.61: J6.3 5.56,12.22 5.56,10.64
N$4
  Bottom 0.152: Q4.DPAD 8.31,15.29 8.57,15.56 17.14,15.56 17.46,15.88 17.46,21.75 18.26,22.54 25.08,22.54 26.35,21.27 26.88,21.27 RA4.6 | Q4.D2 7.34,14.25 7.62,13.97
  Bottom 0.305: 6.03,15.08 6.19,14.92 | 6.19,14.92 7.3,14.92 Q4.D1 | 6.19,14.92 6.19,14.29 | 6.19,14.29 7.33,14.29 Q4.D2 | 6.19,14.29 6.19,13.81 6.35,13.65 | 7.62,13.97 Q4.DPAD | 6.35,13.65 7.33,13.65 Q4.D3 | 6.35,13.65 6.35,13.18 6.51,13.02 7.3,13.02 Q4.D4
  Bottom 0.61: J6.4 4.6,16.51 6.03,15.08
N$5
  Top 0.152: U5.12 81.98,30.41 80.01,32.38 80.01,34.42 C10.2
N$6
  Top 0.152: C10.1 78.87,32.89 81.28,30.48 81.28,29.54 U5.13
N$7
  Top 0.152: U5.6 85.19,25.81 C12.1
N$8
  Top 0.152: U6.P$14 72.06,28.27 71.12,29.21 69.98,29.21 C20.1
N$9  (via drill 0.33)
  Top 0.152: J2.13 28.96,47.37 27.3,45.72 v27.3,38.1
  Bottom 0.152: v27.3,38.1 28.57,36.83 R3.1
N$10
  Top 0.152: J5.P$3 60.21,45.09 U3.P$11
N$11
  Top 0.152: RA1.7 28.11,29.61 D4.A
N$12
  Top 0.152: RA1.8 27.64,31.68 D3.A
N$13  (via drill 0.33)
  Top 0.305: v64.77,31.75 64.77,27.3 62.87,25.4 55.05,25.4 SG1.+
  Bottom 0.305: v64.77,31.75 61.59,34.92 61.59,37.78 | 61.59,37.78 60.01,37.78 Q1.D1 | 61.59,37.78 61.59,38.42 | 61.59,38.42 59.98,38.42 Q1.D2 | 61.59,38.42 61.59,39.05 | 61.59,39.05 59.98,39.05 Q1.D3 59.33,39.06 Q1.DPAD | 61.59,39.05 61.59,39.69 60.01,39.69 Q1.D4
N$14  (via drill 0.33)
  Top 0.152: v34.92,36.83 34.92,36.2 34.29,35.56 31.52,35.56 D2.A
  Bottom 0.152: R3.2 v34.92,36.83
N$16
  Top 0.152: 19.66,19.08 RA5.5 20,19.1 20,23.34 19.53,23.81 13.02,23.81 12.54,23.34 12.54,22.15 12.7,22 D10.A
N$17
  Top 0.152: RA5.6 19.29,18.18 18.41,19.05 D9.A
N$18
  Top 0.152: RA5.7 18.97,17.38 18.41,16.83 14.45,16.83 14.13,16.51 D8.A
N$19
  Top 0.152: D7.A 17.47,13.97 RA5.8
N$21
  Top 0.152: S2.5 27.94,40.92 27.94,36.2 22.86,31.11 19.68,31.11 15.4,26.83 8.29,26.83 J3.2
N$22
  Top 0.152: S2.2 31.08,38.42 28.57,38.42 28.26,38.1 28.26,36.04 23.02,30.8 19.84,30.8 15.4,26.35 9.82,26.35 J3.3
N$24
  Bottom 0.152: 8.26,21.64 8.26,22.86 8.89,23.5 17.78,23.5 18.1,23.18 26.68,23.18 RA4.8
  Bottom 0.305: 6.19,21.75 6.19,22.23 6.51,22.54 7.3,22.54 Q5.D1 | 6.19,21.75 6.03,21.59 6.19,21.43 6.19,21.27 | 6.19,21.75 6.35,21.91 7.33,21.91 Q5.D2 7.98,21.92 8.26,21.64 Q5.DPAD | 6.19,21.27 7.33,21.27 Q5.D3 | 6.19,21.27 6.19,20.95 6.51,20.64 7.3,20.64 Q5.D4
  Bottom 0.61: J6.6 6.03,21.59
N$25
  Bottom 0.152: RA4.7 26.88,21.91 26.35,21.91 25.4,22.86 18.1,22.86 17.14,21.91 17.14,19.68 16.67,19.21 9.21,19.21 9.05,19.05 9.05,18.52 Q6.DPAD | Q6.D2 7.98,18.11
  Bottom 0.305: Q6.D1 7.3,18.73 6.03,18.73 6.03,18.1 | 6.03,18.1 7.33,18.1 Q6.D2 | 7.98,18.11 Q6.DPAD | 6.03,18.1 6.03,17.78 6.35,17.46 | 6.35,17.46 7.33,17.46 Q6.D3 | 6.35,17.46 6.35,16.99 6.51,16.83 7.3,16.83 Q6.D4
  Bottom 0.61: J6.5 4.13,19.05 4.45,18.73 6.03,18.73
N$33  (via drill 0.33)
  other vias: 8.26,7.94
N$34  (via drill 0.33)
  other vias: 3.17,3.81
PYRO1  (via drill 0.33)
  Top 0.152: v16.51,10.79 16.51,12.06 v19.05,14.61 20.32,15.88 21.59,15.88 21.93,16.21 RA5.1 | v88.9,17.78 J2.42
  Bottom 0.152: v16.51,10.79 16.51,9.26 RA2.1 10.37,9.23 Q7.G | v19.05,14.61 20.95,14.61 24.45,18.1 88.58,18.1 v88.9,17.78
PYRO2  (via drill 0.33)
  Top 0.152: RA5.2 22.62,17.38 | 22.62,17.38 22.86,17.14 22.86,15.88 22.23,15.24 20.64,15.24 v17.46,12.06 17.46,10.79 18.73,9.53 20.32,9.53 23.65,12.86 27.62,12.86 28.57,13.81 28.57,17.78 26.51,19.84 v25.24,19.84 | 22.62,17.38 22.54,17.46 | v13.97,13.18 13.97,12.38 v15.24,11.11
  Bottom 0.152: RA2.2 17.46,9.31 v17.46,12.06 16.35,12.06 15.56,11.27 15.4,11.27 v15.24,11.11 | J2.43 95.25,21.59 93.34,21.59 90.81,19.05 26.04,19.05 v25.24,19.84 | Q4.G 13.77,12.98 v13.97,13.18
PYRO3  (via drill 0.33)
  Top 0.152: v18.41,11.43 18.41,12.06 20.95,14.61 22.23,14.61 23.18,15.56 23.18,17.46 22.46,18.18 RA5.3 21.69,18.41 20.95,18.41 20.95,20 v21.27,20.32 | v18.41,17.78 17.78,17.14 v13.81,17.14
  Bottom 0.152: RA2.3 18.1,9.31 18.1,9.84 18.41,10.16 v18.41,11.43 v18.41,17.78 | J2.44 92.71,20.32 91.12,18.73 25.08,18.73 23.5,20.32 v21.27,20.32 | v13.81,17.14 13.49,16.83 10.35,16.83 Q6.G
PYRO4  (via drill 0.33)
  Top 0.152: 21.93,19.34 RA5.4 23.15,19.08 v23.81,18.41 23.5,18.1 23.5,15.24 22.23,13.97 21.27,13.97 19.37,12.06 v19.37,10.79 | 21.93,19.34 22.23,19.05 | 21.93,19.34 21.93,23.79 21.59,24.13 8.89,24.13 5.71,20.95 v5.71,20.16
  Bottom 0.152: v19.37,10.79 19.37,9.52 RA2.4 | v23.81,18.41 91.44,18.41 92.08,19.05 95.25,19.05 J2.45 | 10.31,20.47 Q5.G 9.87,20.16 v5.71,20.16
RESET
  Top 0.152: J2.RESET 31.75,1.27 22.86,1.27 S1.1 S1.2
SCL  (via drill 0.33)
  Top 0.152: v74.3,27.3 74.61,27 U6.P$2 74.61,24.14 76.04,22.7 76.83,22.7 77.79,21.75 | U5.2 81.92,26.37 v81.92,24.13 81.92,22.23 83.19,20.95 90.17,20.95 90.81,21.59 90.81,34.29 v87.95,37.15 Q3.2 | 77.79,21.75 77.79,21.62 U4.5 | 77.79,21.75 77.63,21.75 | 77.63,21.75 77.47,21.59 | Q3.2 | Q3.2 87.95,44.77 86.68,46.04 v86.04,46.04 | v79.06,24.13 77.79,22.86 77.79,21.91 77.63,21.75
  Bottom 0.152: v79.06,24.13 v81.92,24.13 | v87.95,37.15 86.36,38.73 76.83,38.73 74.3,36.2 v74.3,27.3 | 84.69,46.76 RA6.6 84.24,46.83 85.25,46.83 v86.04,46.04
SCLK  (via drill 0.33)
  Top 0.152: v25.4,40.01 v21.43,40.01 5.91,40.01 J4.5 | v21.43,28.89 25.61,28.89 RA1.3
  Bottom 0.152: U2.12 33.02,40.01 32.38,39.37 31.11,39.37 30.48,40.01 v25.4,40.01 | v21.43,28.89 v21.43,40.01
SDA  (via drill 0.33)
  Top 0.152: v82.55,39.37 81.13,39.37 Q2.2 81.28,39.22 81.28,38.73 90.17,29.84 90.17,21.59 89.85,21.27 83.5,21.27 82.78,21.99 82.78,22.78 | U5.3 82.78,22.78 | v74.93,22.86 74.91,22.73 76.03,21.61 U4.6 | v75.25,24.45 75.25,25.93 U6.P$3 v75.25,28.57 | 82.78,22.78 v82.87,22.86 | v77.47,38.1 79.38,38.1 80.64,39.37 | v83.19,41.77 83.19,45.09 v85.72,47.62
  Bottom 0.152: 84.45,47.62 84.42,47.66 RA6.5 84.19,47.62 v85.72,47.62 | v83.19,41.77 83.19,40.01 v82.55,39.37 | v75.25,24.45 74.93,23.81 v74.93,22.86 v82.87,22.86 | v77.47,38.1 75.25,35.88 v75.25,28.57
SDCS  (via drill 0.33)
  Top 0.152: J4.2 6.27,36.75 6.35,36.83 v9.53,36.83
  Bottom 0.152: v9.53,36.83 10.16,36.83 19.05,45.72 33.66,45.72 35.56,43.81 U2.15
TX0  (via drill 0.33)
  Top 0.152: S2.1 39.33,44.41 v39.37,44.45
  Bottom 0.152: v39.37,44.45 41.27,44.45 41.91,43.81 U2.2
TX1  (via drill 0.33)
  Top 0.152: S2.3 38.14,39.41 v40.01,41.27
  Bottom 0.152: v40.01,41.27 U2.4
TX2  (via drill 0.33)
  Top 0.152: U3.P$10 60.09,31.67 v60.01,31.75
  Bottom 0.152: v60.01,31.75 57.47,34.29 42.55,34.29 40.64,36.2 40.64,38.1 41.27,38.73 U2.6
VCC3  (via drill 0.33)
  Top 0.305: v20.32,42.55 20.32,43.81 19.55,44.58 | 5.07,38.75 J4.4 5.46,38.73 4.45,38.73 4.13,39.05 4.13,42.23 4.45,42.55 4.45,43.81 5.08,44.45 C7.1 19.55,44.58 | v20.32,27.94 25.66,27.94 RA1.4 25.7,27.64 27.94,25.4 34.92,25.4 39.37,29.84 C8.1 C9.1 42.93,29.96 U3.P$1 | v43.81,45.09 46.35,42.55 46.35,29.57 U3.P$1 | Q2.1 75.61,39.54 | 75.61,39.54 C15.1 C16.1 71.12,33.02 68.58,30.48 68.58,27.78 68.42,27.62 | Q2.1 75.73,39.54 | Q2.1 79.06,40.33 79.38,40.64 85.09,40.64 85.72,40.01 85.72,39.85 Q3.1 86.05,39.05 v86.04,37.78 | v79.38,29.21 79.38,28.57 80.01,27.94 U5.14 81.19,27.44 U5.1 81.28,26.34 81.28,25.72 80.64,25.08 80.64,19.68 79.16,18.2 U4.3 | U7.14 U7.15 77.62,13.02 70.96,13.02 70.99,12.99 C21.1 | U4.3 79.19,17.91 81.75,17.91 C11.1 | U4.3 U4.2 77.02,16.67 75.72,16.67 | 75.72,16.67 73.95,18.44 U6.P$1 U6.P$16 U6.P$15 68.42,27.62 | U3.P$1 46.59,22.46 44.45,20.32 C3.1 | 68.42,27.62 68.26,27.62 63.5,22.86 60.33,22.86 54.61,17.14 | v80.64,44.77 80.64,44.58 75.61,39.54 | C3.1 C21.1 | SG1.- 47.94,16.95 C3.1 | 19.55,44.58 19.55,44.95 20.48,45.88 23.65,45.88 v25.4,47.62 | C21.1 71.25,13.46 72.39,14.61 73.66,14.61 75.72,16.67
  Top 0.61: U1.4 35.56,12.06 36.83,13.34 37.97,13.34 C5.1 C4.1 C3.1
  Bottom 0.305: C2.1 C1.1 7.12,31.25 5.08,29.21 5.08,25.61 J3.1 | C2.1 15.88,32.38 20.32,36.83 v20.32,42.55 | C2.1 17.02,31.25 v20.32,27.94 | U2.1 v43.81,45.09 | RA6.4 RA6.3 82.13,46.67 81.28,46.67 80.64,46.04 v80.64,44.77 | v86.04,37.78 86.04,36.01 C14.1 C13.1 | v79.38,29.21 79.38,29.84 80.01,30.48 85.09,30.48 86.36,31.75 86.36,32.7 86.68,33.02 | v25.4,47.62 39.37,47.62 41.91,45.09
VIN  (via drill 0.33)
  Top 0.305: J2.VIN 47.62,4.45 v71.12,4.45
  Top 0.61: J2.VIN 41.91,6.35 C6.1 26.16,9.24 U1.3 25.22,9.53 22.86,9.53 20.95,7.62 D1.C
  Bottom 0.305: v71.12,4.45 73.5,6.83 75.25,6.83 75.25,7.15 R2.2
XRSSI
  Top 0.152: J3.6 14.88,25.2 19.21,29.53 25.61,29.53 RA1.2

### Text on the board
tPlace: L | BZR | XB0 | GPS | XB1 | XB0 | GPSANT | MicroSD | XB1 | L | FIX | XBee | RSSI | SD | 3.3V | TX | RX | RSSI | GND | PWR | 4 | 3 | 2 | 1 | OpenSourceAerospace.com | RocketMega R2.1 | RESET | C1 | C2 | C3 | C4 | Z | Y | X | V
bPlace: Open Source Hardware